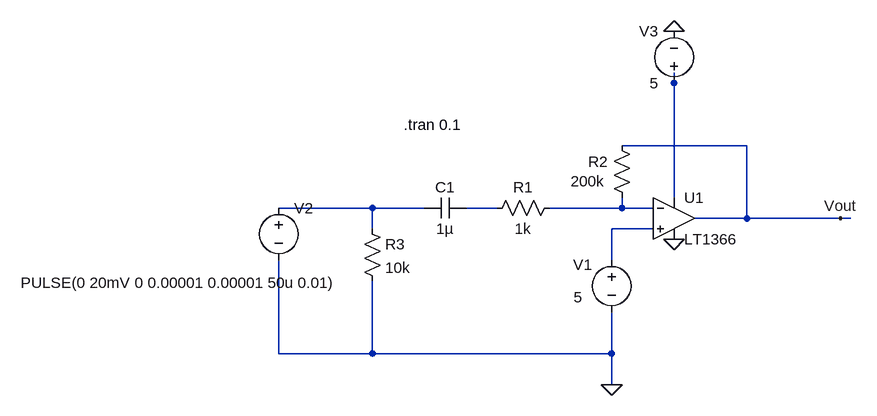
[diagram p0: schematic 200x amplification.asc]
200x amplification.asc, the LTspice schematic file:
Version 4.1
SHEET 1 880 680
WIRE 560 -128 560 -144
WIRE 672 -32 480 -32
WIRE 560 48 560 -128
WIRE 96 64 -48 64
WIRE 176 64 96 64
WIRE 288 64 240 64
WIRE 480 64 480 48
WIRE 480 64 368 64
WIRE 528 64 480 64
WIRE 672 80 672 -32
WIRE 672 80 592 80
WIRE 816 80 672 80
WIRE 832 80 816 80
WIRE 96 96 96 64
WIRE 528 96 464 96
WIRE 464 144 464 96
WIRE -48 288 -48 144
WIRE 96 288 96 176
WIRE 96 288 -48 288
WIRE 464 288 464 224
WIRE 464 288 96 288
WIRE 464 336 464 288
FLAG 560 112 0
FLAG 464 336 0
FLAG 816 80 Vout
FLAG 560 -208 0
SYMBOL res 384 48 R90
WINDOW 0 0 56 VBottom 2
WINDOW 3 32 56 VTop 2
SYMATTR InstName R1
SYMATTR Value 1k
SYMBOL voltage 464 128 R0
WINDOW 123 0 0 Left 0
WINDOW 39 0 0 Left 0
WINDOW 0 -59 23 Left 2
WINDOW 3 -58 73 Left 2
SYMATTR InstName V1
SYMATTR Value 5
SYMBOL cap 240 48 R90
WINDOW 0 0 32 VBottom 2
WINDOW 3 32 32 VTop 2
SYMATTR InstName C1
SYMATTR Value 1µ
SYMBOL voltage -48 48 R0
WINDOW 3 -397 131 Left 2
WINDOW 123 0 0 Left 0
WINDOW 39 0 0 Left 0
SYMATTR Value PULSE(0 20mV 0 0.00001 0.00001 50u 0.01)
SYMATTR InstName V2
SYMBOL res 464 -48 R0
WINDOW 0 -36 41 Left 2
WINDOW 3 -63 71 Left 2
SYMATTR InstName R2
SYMATTR Value 200k
SYMBOL OpAmps\\LT1366 560 16 R0
SYMATTR InstName U1
SYMBOL res 80 80 R0
SYMATTR InstName R3
SYMATTR Value 10k
SYMBOL voltage 560 -112 R180
WINDOW 0 24 96 Left 2
WINDOW 3 24 16 Left 2
WINDOW 123 0 0 Left 0
WINDOW 39 0 0 Left 0
SYMATTR InstName V3
SYMATTR Value 5
TEXT 144 -64 Left 2 !.tran 0.1

The netlist it stands for:
* 200x amplification.asc
R1 N004 N003 1k
V1 N005 0 5
C1 N003 N002 1µ
V2 N002 0 PULSE(0 20mV 0 0.00001 0.00001 50u 0.01)
R2 Vout N004 200k
X§U1 N005 N004 N001 0 Vout LT1366  ; pins In+ In- V+ V- OUT
R3 N002 0 10k
V3 N001 0 5
.tran 0.1
.lib LTC.lib
.backanno
.end